# EAGLE schematic water_bot_controller (EAGLE 8.3.2)
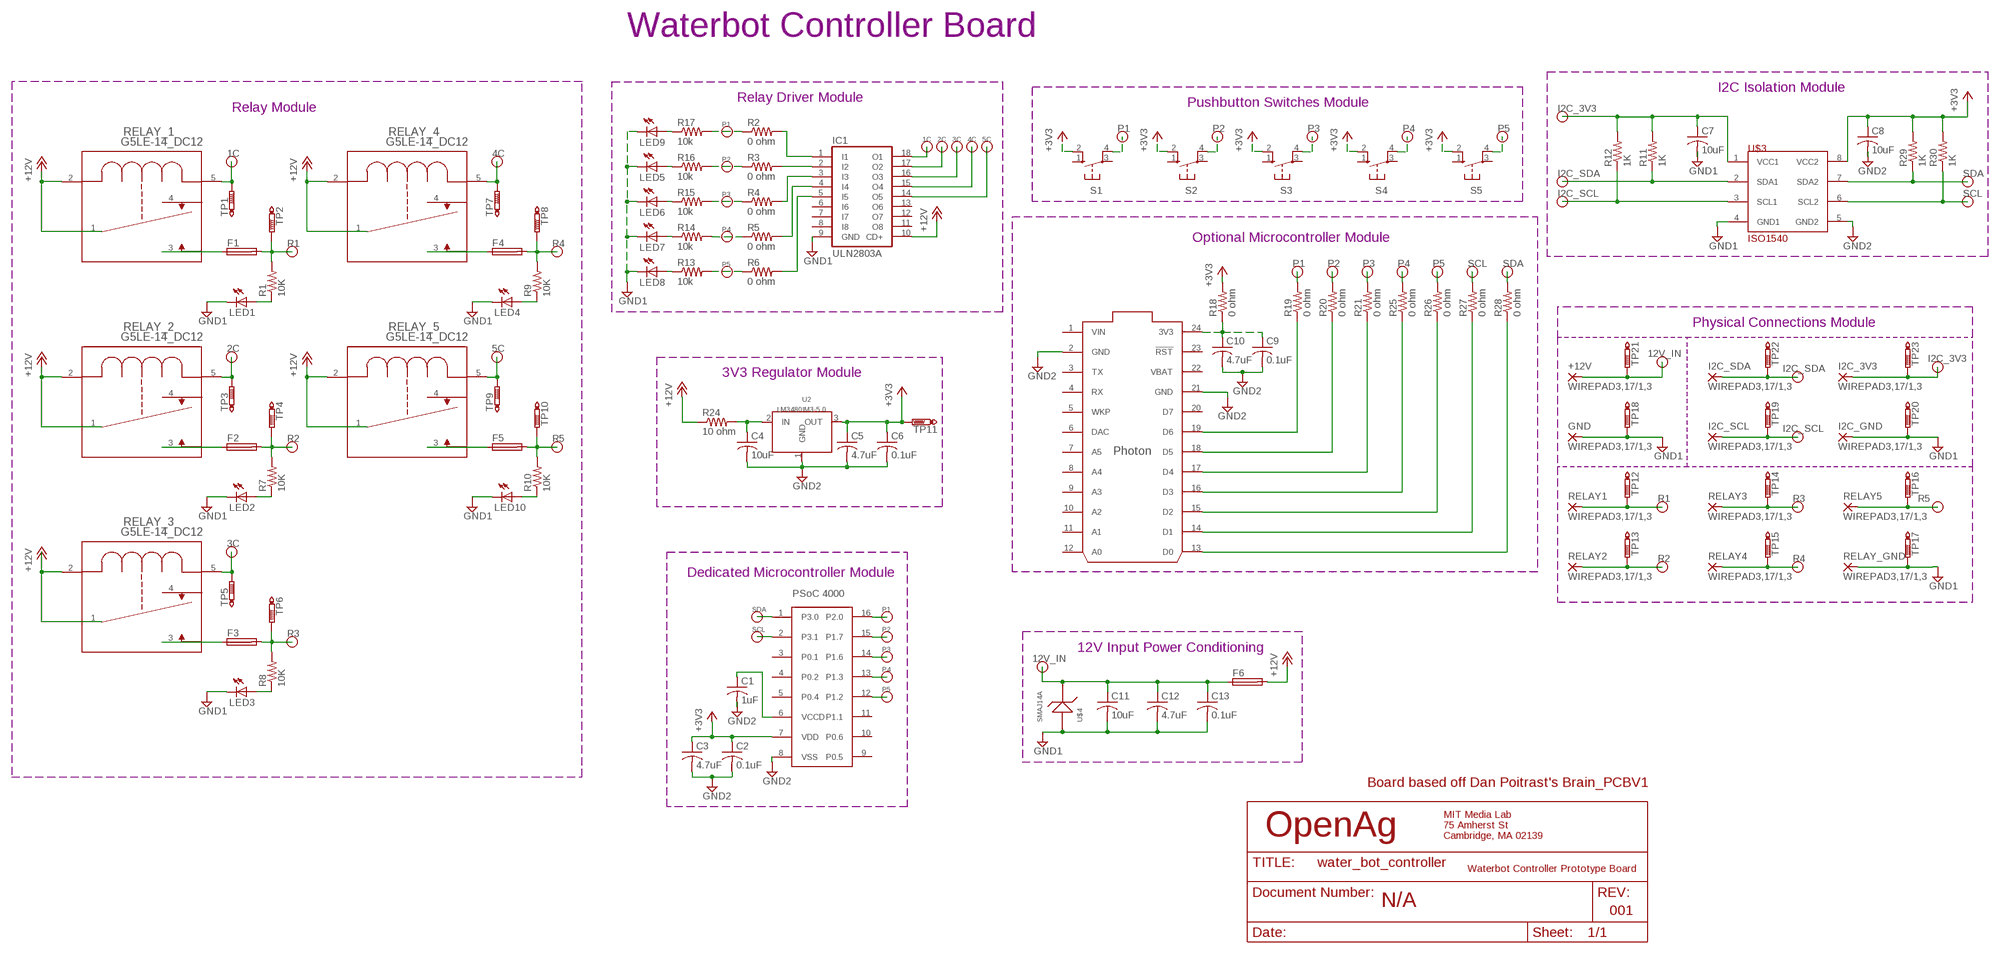
[diagram p0: schematic, sheet 1]

## Parts
+12V  WIREPAD3,17/1,3  [3,17/1,3]
C1  1uF  C-USC0603  [C0603]
C2  0.1uF  C-USC0603  [C0603]
C3  4.7uF  C-USC1206  [C1206]
C4  10uF  C-USC1206  [C1206]
C5  4.7uF  C-USC1206  [C1206]
C6  0.1uF  C-USC0603  [C0603]
C7  10uF  C-USC1206  [C1206]
C8  10uF  C-USC1206  [C1206]
C9  0.1uF  C-USC0603  [C0603]
C10  4.7uF  C-USC1206  [C1206]
C11  10uF  C-USC1206  [C1206]
C12  4.7uF  C-USC1206  [C1206]
C13  0.1uF  C-USC0603  [C0603]
F1  GSH15  [GSH15]
F2  GSH15  [GSH15]
F3  GSH15  [GSH15]
F4  GSH15  [GSH15]
F5  GSH15  [GSH15]
F6  GSH15  [GSH15]
GND  WIREPAD3,17/1,3  [3,17/1,3]
I2C_3V3  WIREPAD3,17/1,3  [3,17/1,3]
I2C_GND  WIREPAD3,17/1,3  [3,17/1,3]
I2C_SCL  WIREPAD3,17/1,3  [3,17/1,3]
I2C_SDA  WIREPAD3,17/1,3  [3,17/1,3]
IC1  ULN2803A  [DIL18]
LED1  LEDCHIP-LED0603  [CHIP-LED0603]
LED2  LEDCHIP-LED0603  [CHIP-LED0603]
LED3  LEDCHIP-LED0603  [CHIP-LED0603]
LED4  LEDCHIP-LED0603  [CHIP-LED0603]
LED5  LEDCHIP-LED0603  [CHIP-LED0603]
LED6  LEDCHIP-LED0603  [CHIP-LED0603]
LED7  LEDCHIP-LED0603  [CHIP-LED0603]
LED8  LEDCHIP-LED0603  [CHIP-LED0603]
LED9  LED  [SMARTLED-TTW]
LED10  LEDCHIP-LED0603  [CHIP-LED0603]
R1  10K  R-US_R0603  [R0603]
R2  0 ohm  R-US_R0603  [R0603]
R3  0 ohm  R-US_R0603  [R0603]
R4  0 ohm  R-US_R0603  [R0603]
R5  0 ohm  R-US_R0603  [R0603]
R6  0 ohm  R-US_R0603  [R0603]
R7  10K  R-US_R0603  [R0603]
R8  10K  R-US_R0603  [R0603]
R9  10K  R-US_R0603  [R0603]
R10  10K  R-US_R0603  [R0603]
R11  1K  R-US_R0603  [R0603]
R12  1K  R-US_R0603  [R0603]
R13  10k  R-US_R0603  [R0603]
R14  10k  R-US_R0603  [R0603]
R15  10k  R-US_R0603  [R0603]
R16  10k  R-US_R0603  [R0603]
R17  10k  R-US_R0603  [R0603]
R18  0 ohm  R-US_R0603  [R0603]
R19  0 ohm  R-US_R0603  [R0603]
R20  0 ohm  R-US_R0603  [R0603]
R21  0 ohm  R-US_R0603  [R0603]
R24  10 ohm  R-US_R0603  [R0603]
R25  0 ohm  R-US_R0603  [R0603]
R26  0 ohm  R-US_R0603  [R0603]
R27  0 ohm  R-US_R0603  [R0603]
R28  0 ohm  R-US_R0603  [R0603]
R29  1K  R-US_R0603  [R0603]
R30  1K  R-US_R0603  [R0603]
RELAY1  WIREPAD3,17/1,3  [3,17/1,3]
RELAY2  WIREPAD3,17/1,3  [3,17/1,3]
RELAY3  WIREPAD3,17/1,3  [3,17/1,3]
RELAY4  WIREPAD3,17/1,3  [3,17/1,3]
RELAY5  WIREPAD3,17/1,3  [3,17/1,3]
RELAY_1  G5LE-14_DC12  [RELAY_G5LE-1]
RELAY_2  G5LE-14_DC12  [RELAY_G5LE-1]
RELAY_3  G5LE-14_DC12  [RELAY_G5LE-1]
RELAY_4  G5LE-14_DC12  [RELAY_G5LE-1]
RELAY_5  G5LE-14_DC12  [RELAY_G5LE-1]
RELAY_GND  WIREPAD3,17/1,3  [3,17/1,3]
S1  10-XX  [B3F-10XX]
S2  10-XX  [B3F-10XX]
S3  10-XX  [B3F-10XX]
S4  10-XX  [B3F-10XX]
S5  10-XX  [B3F-10XX]
TP1  PTR1B2,54  [B2,54]
TP2  PTR1B2,54  [B2,54]
TP3  PTR1B2,54  [B2,54]
TP4  PTR1B2,54  [B2,54]
TP5  PTR1B2,54  [B2,54]
TP6  PTR1B2,54  [B2,54]
TP7  PTR1B2,54  [B2,54]
TP8  PTR1B2,54  [B2,54]
TP9  PTR1B2,54  [B2,54]
TP10  PTR1B2,54  [B2,54]
TP11  PTR1B2,54  [B2,54]
TP12  PTR1B2,54  [B2,54]
TP13  PTR1B2,54  [B2,54]
TP14  PTR1B2,54  [B2,54]
TP15  PTR1B2,54  [B2,54]
TP16  PTR1B2,54  [B2,54]
TP17  PTR1B2,54  [B2,54]
TP18  PTR1B2,54  [B2,54]
TP19  PTR1B2,54  [B2,54]
TP20  PTR1B2,54  [B2,54]
TP21  PTR1B2,54  [B2,54]
TP22  PTR1B2,54  [B2,54]
TP23  PTR1B2,54  [B2,54]
U2  LM3480IM3-5.0  [SOT-23]
U$1  PSOC_4000  [SOIC16]
U$2  PHOTON_WITH_HEADERS  [PHOTON]
U$3  ISO1540  [SOIC8]
U$4  SMAJ14A  [DO-214AC]

## Nets
1C: IC1.18(O1) RELAY_1.5 TP1.TP
2C: IC1.17(O2) RELAY_2.5 TP3.TP
3C: IC1.16(O3) RELAY_3.5 TP5.TP
4C: IC1.15(O4) RELAY_4.5 TP7.TP
5C: IC1.14(O5) RELAY_5.5 TP9.TP
12V_IN: +12V.1(P) C11.1 C12.1 C13.1 F6.1 TP21.TP U$4.C
+3V3: C2.1 C3.1 C5.1 C6.1 C8.1 R18.2 R29.2 R30.2 S1.2(S1) S2.2(S1) S3.2(S1) S4.2(S1) S5.2(S1) TP11.TP U2.3(OUT) U$1.7(VDD) U$3.8(VCC2)
+12V: F6.2 IC1.10(CD+) R24.1 RELAY_1.1 RELAY_1.2 RELAY_2.1 RELAY_2.2 RELAY_3.1 RELAY_3.2 RELAY_4.1 RELAY_4.2 RELAY_5.1 RELAY_5.2
GND1: C7.2 C11.2 C12.2 C13.2 GND.1(P) I2C_GND.1(P) IC1.9(GND) LED1.C LED2.C LED3.C LED4.C LED5.C LED6.C LED7.C LED8.C LED9.C@1(C) LED10.C RELAY_GND.1(P) TP17.TP TP18.TP TP20.TP U$3.4(GND1) U$4.A
GND2: C1.2 C2.2 C3.2 C4.2 C5.2 C6.2 C8.2 C9.2 C10.2 U2.1(GND) U$1.8(VSS) U$2.2(GND) U$2.21(GND) U$3.5(GND2)
I2C_3V3: C7.1 I2C_3V3.1(P) R11.2 R12.2 TP23.TP U$3.1(VCC1)
I2C_SCL: I2C_SCL.1(P) R12.1 TP19.TP U$3.3(SCL1)
I2C_SDA: I2C_SDA.1(P) R11.1 TP22.TP U$3.2(SDA1)
N$1: LED1.A R1.1
N$2: F1.1 RELAY_1.3
N$3: F2.1 RELAY_2.3
N$4: LED2.A R7.1
N$5: IC1.1(I1) R2.2
N$6: R3.2
N$7: IC1.3(I3) R4.2
N$8: IC1.5(I5) R6.2
N$9: IC1.4(I4) R5.2
N$10: F3.1 RELAY_3.3
N$11: LED3.A R8.1
N$12: F4.1 RELAY_4.3
N$13: LED9.A@1(A) R17.1
N$14: LED5.A R16.1
N$15: LED6.A R15.1
N$16: LED7.A R14.1
N$17: LED8.A R13.1
N$18: LED4.A R9.1
N$19: F5.1 RELAY_5.3
N$20: LED10.A R10.1
N$21: R26.1 U$2.15(D2)
N$22: R27.1 U$2.14(D1)
N$23: C9.1 C10.1 R18.1 U$2.24(3V3)
N$24: R19.1 U$2.19(D6)
N$25: R20.1 U$2.18(D5)
N$26: R21.1 U$2.17(D4)
N$27: R25.1 U$2.16(D3)
N$28: R28.1 U$2.13(D0)
N$29: C1.1 U$1.6(VCCD)
N$39: C4.1 R24.2 U2.2(IN)
P1: R2.1 R17.2 R19.2 S1.4(P1) U$1.16(P2.0)
P2: R3.1 R16.2 R20.2 S2.4(P1) U$1.15(P1.7)
P3: R4.1 R15.2 R21.2 S3.4(P1) U$1.14(P1.6)
P4: R5.1 R14.2 R25.2 S4.4(P1) U$1.13(P1.3)
P5: R6.1 R13.2 R26.2 S5.4(P1) U$1.12(P1.2)
R1: F1.2 R1.2 RELAY1.1(P) TP2.TP TP12.TP
R2: F2.2 R7.2 RELAY2.1(P) TP4.TP TP13.TP
R3: F3.2 R8.2 RELAY3.1(P) TP6.TP TP14.TP
R4: F4.2 R9.2 RELAY4.1(P) TP8.TP TP15.TP
R5: F5.2 R10.2 RELAY5.1(P) TP10.TP TP16.TP
SCL: R27.2 R30.1 U$1.2(P3.1) U$3.6(SCL2)
SDA: R28.2 R29.1 U$1.1(P3.0) U$3.7(SDA2)
Unconnected: IC1.2(I2) IC1.6(I6) IC1.7(I7) IC1.8(I8) IC1.11(O8) IC1.12(O7) IC1.13(O6) RELAY_1.4 RELAY_2.4 RELAY_3.4 RELAY_4.4 RELAY_5.4 S1.1(S) S1.3(P) S2.1(S) S2.3(P) S3.1(S) S3.3(P) S4.1(S) S4.3(P) S5.1(S) S5.3(P) U$1.3(P0.1) U$1.4(P0.2) U$1.5(P0.4) U$1.9(P0.5) U$1.10(P0.6) U$1.11(P1.1) U$2.3(TX) U$2.4(RX) U$2.5(WKP) U$2.6(DAC) U$2.7(A5) U$2.8(A4) U$2.9(A3) U$2.10(A2) U$2.11(A1) U$2.12(A0) U$2.20(D7) U$2.23(!RST)

## Notes on the sheet
- Waterbot Controller Board
- I2C Isolation Module
- Relay Driver Module
- Pushbutton Switches Module
- Relay Module
- Optional Microcontroller Module
- Physical Connections Module
- 3V3 Regulator Module
- LM3480IM3-5.0
- Dedicated Microcontroller Module
- 12V Input Power Conditioning
- Board based off Dan Poitrast's Brain_PCBV1
- OpenAg
- MIT Media Lab
  75 Amherst St
  Cambridge, MA 02139
- Waterbot Controller Prototype Board
- N/A
- 001

## Power pins joined to a net without a drawn wire
VBAT: U$2.22(VBAT)
VIN: U$2.1(VIN)

## Library data of the parts
+12V GND I2C_3V3 I2C_GND I2C_SCL I2C_SDA RELAY1-RELAY5 RELAY_GND = wirepad:WIREPAD: Wire PAD connect wire on PCB
C1-C13 = rcl:C-US: CAPACITOR, American symbol
F1-F6 = fuse:GSH15: FUSE HOLDER grid 15mm, 19649 Wickmann; MPN: 64900001039; OC_FARNELL: 1271673; OC_NEWARK: 02P0318
IC1 = uln-udn:ULN2803A: DRIVER ARRAY
LED1-LED10 = led:LED: LED OSRAM: - CHIPLED LG R971, LG N971, LY N971, LG Q971, LY Q971, LO R971, LY R971 LH N974, LH R974 LS Q976, LO Q976, LY Q976 LO Q996 - Hyper CHIPLED LW Q18S LB Q993, LB Q99A, LB R99A - SideLED LS A670, LO A670, LY A670, LG A670, LP A670 LB A673, LV A673, LT A673, LW A673 LH A674 LY A675 LS A676, LA A676, LO A676, LY A676, LW A676 LS A679, LY A679, LG A679 - Hyper Micro SIDELED® LS Y876, LA Y876, LO Y876, LY Y876 LT Y87S - SmartLED LW L88C, LW L88S LB L89C, LB L89S, LG L890 LS L89K, LO L89K, LY L89K LS L896, LA L896, LO L896, LY L896 - TOPLED LS T670, LO T670, LY T670, LG T670, LP T670 LSG T670, LSP T670, LSY T670, LOP T670, LYG T670 LG T671, LOG T671, LSG T671 LB T673, LV T673, LT T673, LW T673 LH T674 LS T676, LA T676, LO T676, LY T676, LB T676, LH T676, LSB T676, LW T676 LB T67C, LV T67C, LT T67C, LS T67K, LO T67K, LY T67K, LW E67C LS E67B, LA E67B, LO E67B, LY E67B, LB E67C, LV E67C, LT E67C LW T67C LS T679, LY T679, LG T679 LS T770, LO T770, LY T770, LG T770, LP T770 LB T773, LV T773, LT T773, LW T773 LH T774 LS E675, LA E675, LY E675, LS T675 LS T776, LA T776, LO T776, LY T776, LB T776 LHGB T686 LT T68C, LB T68C - Hyper Mini TOPLED® LB M676 - Mini TOPLED Santana® LG M470 LS M47K, LO M47K, LY M47K Source: http://www.osram.convergy.de LUXEON: - LUMILED® LXK2-PW12-R00, LXK2-PW12-S00, LXK2-PW14-U00, LXK2-PW14-V00 LXK2-PM12-R00, LXK2-PM12-S00, LXK2-PM14-U00 LXK2-PE12-Q00, LXK2-PE12-R00, LXK2-PE12-S00, LXK2-PE14-T00, LXK2-PE14-U00 LXK2-PB12-K00, LXK2-PB12-L00, LXK2-PB12-M00, LXK2-PB14-N00, LXK2-PB14-P00, LXK2-PB14-Q00 LXK2-PR12-L00, LXK2-PR12-M00, LXK2-PR14-Q00, LXK2-PR14-R00 LXK2-PD12-Q00, LXK2-PD12-R00, LXK2-PD12-S00 LXK2-PH12-R00, LXK2-PH12-S00 LXK2-PL12-P00, LXK2-PL12-Q00, LXK2-PL12-R00 Source: www.luxeon.com KINGBRIGHT: KA-3528ASYC Source: www.kingbright.com
R1-R21 R24-R30 = rcl:R-US_: RESISTOR, American symbol
RELAY_1-RELAY_5 = relay_2:G5LE-14_DC12; MANUFACTURER_PART_NUMBER: G5LE14 DC12; VENDOR: OMRON
S1-S5 = switch-omron:10-XX: OMRON SWITCH; MPN: B3F-1000; OC_FARNELL: 176432; OC_NEWARK: 36M3542
TP1-TP23 = testpad:PTR1: TEST PIN
U2 = LEDdynamics:LM3480IM3-5.0
U$1 = stovelite:PSOC_4000
U$2 = Spark:PHOTON
U$3 = ISO1540:ISO1540
U$4 = openag_diodes:SMAJ14A: TVS DIODE 14VWM 23.2VC SMA - https://www.digikey.com/product-detail/en/littelfuse-inc/SMAJ14A/SMAJ14ALFCT-ND/762486